# EAGLE design SparkFun_Qwiic_6DoF_BMI270 (EAGLE 9.6.2)
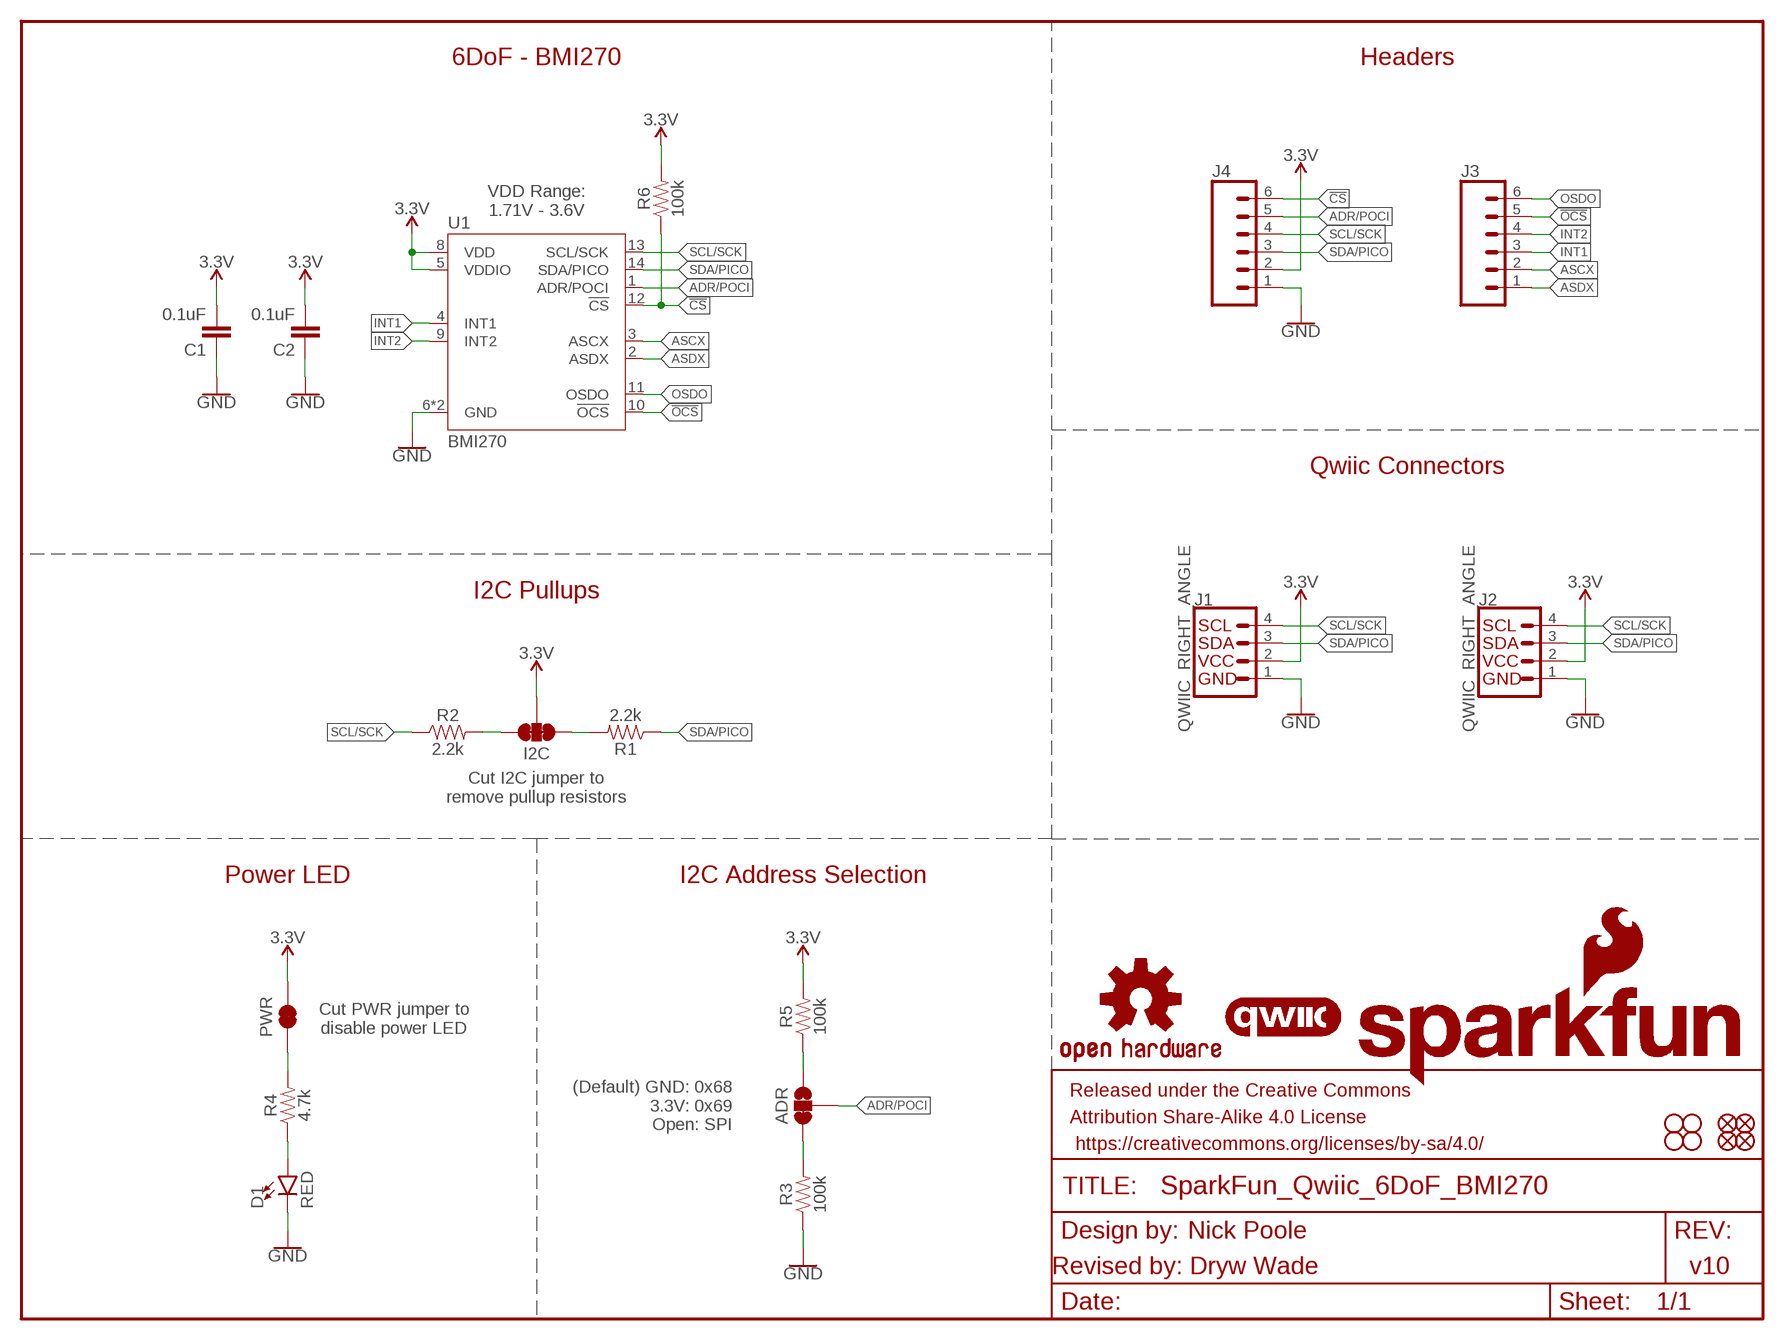
[diagram p0: schematic, sheet 1]

## Parts
ADR  JUMPER-SMT_3_1-NC_TRACE_SILK  [SMT-JUMPER_3_1-NC_TRACE_SILK]
C1  0.1uF  0.1UF-0603-25V-(+80/-20%)  [0603]
C2  0.1uF  0.1UF-0603-25V-(+80/-20%)  [0603]
D1  RED  LED-RED_0603-KB  [LED-0603]
FD1  FIDUCIAL1X2  [FIDUCIAL-1X2]
FD2  FIDUCIAL1X2  [FIDUCIAL-1X2]
FD3  FIDUCIAL1X2  [FIDUCIAL-1X2]
FD4  FIDUCIAL1X2  [FIDUCIAL-1X2]
FRAME1  FRAME-LETTER  [CREATIVE_COMMONS]
H1  STAND-OFF  [STAND-OFF]
H2  STAND-OFF  [STAND-OFF]
H3  STAND-OFF  [STAND-OFF]
H4  STAND-OFF  [STAND-OFF]
I2C  JUMPER-SMT_3_2-NC_TRACE_SILK  [SMT-JUMPER_3_2-NC_TRACE_SILK]
J1  QWIIC_RIGHT_ANGLE  QWIIC_CONNECTORJS-1MM  [JST04_1MM_RA]
J2  QWIIC_RIGHT_ANGLE  QWIIC_CONNECTORJS-1MM  [JST04_1MM_RA]
J3  CONN_06NO_SILK_NO_POP  [1X06_NO_SILK]
J4  CONN_06NO_SILK_NO_POP  [1X06_NO_SILK]
LOGO1  SFE_LOGO_NAME_FLAME.1_INCH  [SFE_LOGO_NAME_FLAME_.1]
LOGO2  QWIIC_LOGO_5MM  [QWIIC_5MM]
LOGO3  OSHW-LOGOS  [OSHW-LOGO-S]
PWR  JUMPER-SMT_2_NC_TRACE_SILK  [SMT-JUMPER_2_NC_TRACE_SILK]
R1  2.2k  2.2KOHM-0603-1/10W-1%  [0603]
R2  2.2k  2.2KOHM-0603-1/10W-1%  [0603]
R3  100k  100KOHM-0603-1/10W-1%  [0603]
R4  4.7k  4.7KOHM-0603-1/10W-1%  [0603]
R5  100k  100KOHM-0603-1/10W-1%  [0603]
R6  100k  100KOHM-0603-1/10W-1%  [0603]
U1  BMI270  [BMI270]

## Nets
3.3V: C1.2 C2.2 I2C.2 J1.2 J2.2 J4.2 PWR.2 R5.2 R6.2 U1.5(VDDIO) U1.8(VDD)
!CS!: J4.6 R6.1 U1.12(!CS!)
!OCS!: J3.5 U1.10(!OCS!)
ADR/POCI: ADR.2 J4.5 U1.1(ADR/POCI)
ASCX: J3.2 U1.3(ASCX)
ASDX: J3.1 U1.2(ASDX)
GND: C1.1 C2.1 D1.C J1.1 J2.1 J4.1 R3.1 U1.6(GND) U1.7(GND)
INT1: J3.3 U1.4(INT1)
INT2: J3.4 U1.9(INT2)
N$1: I2C.1 R1.2
N$2: I2C.3 R2.2
N$3: PWR.1 R4.2
N$4: D1.A R4.1
N$5: ADR.1 R5.1
N$6: ADR.3 R3.2
OSDO: J3.6 U1.11(OSDO)
SCL/SCK: J1.4 J2.4 J4.4 R2.1 U1.13(SCL/SCK)
SDA/PICO: J1.3 J2.3 J4.3 R1.1 U1.14(SDA/PICO)

## Notes on the sheet
- 6DoF - BMI270 | Headers
- VDD Range:
  1.71V - 3.6V
- Qwiic Connectors
- I2C Pullups
- Cut I2C jumper to
  remove pullup resistors
- Power LED | I2C Address Selection
- Cut PWR jumper to
  disable power LED
- (Default) GND: 0x68
  3.3V: 0x69
  Open: SPI
- Nick Poole
- Revised by: Dryw Wade | v10

## Library data of the parts
ADR = SparkFun-Jumpers:JUMPER-SMT_3_1-NC_TRACE: Normally closed trace jumper (1 of 2 connections) This jumper has a trace between two pads so it's normally closed (NC). The other connection is normally open (NO). Use a razor knife to open the connection. For best results follow the IPC guidelines for cutting traces: Cutout at least 0.063 mm (0.005 in). Remove all loose material to clean up the cut area. Seal the cut with an approved epoxy. Reapply solder to reclose the connection, or to close the NO connection.
C1 C2 = SparkFun-Capacitors:0.1UF: 0.1µF ceramic capacitors A capacitor is a passive two-terminal electrical component used to store electrical energy temporarily in an electric field.; PROD_ID: CAP-00810
D1 = SparkFun-LED:LED-RED: Red SMD LED Used in manufacturing of most products at SparkFun Packages: 0603 - KB - KingBright (DIO-17976) SMD 0603 package [Datasheet] <https://www.kingbrightusa.com/images/catalog/SPEC/APT1608SURCK.pdf> 0603 - (DIO-00819, has gone EOL) SMD 0603 package 0603 SMART - SMD 0603 SMART package ( more efficient and expensive)[Product Link] <http://www.osram-os.com/Graphics/XPic2/00077099_0.pdf> 1206 - SMD1206 package [Product Link] <https://www.sparkfun.com/datasheets/DevTools/LilyPad/Q150OVS4.pdff> SparkFun Products: Pro Mini 328 -5V <https://www.sparkfun.com/products/821> RedBoard <https://www.sparkfun.com/products/12757> IOIO-OTG <https://www.sparkfun.com/products/13613>; PROD_ID: DIO-17976
FD1-FD4 = SparkFun-Aesthetics:FIDUCIAL: Fiducial Alignment Points Point-of-reference for pick-and-place machines and other optical instruments.
FRAME1 = SparkFun-Aesthetics:FRAME-LETTER: Schematic Frame - Letter Standard 8.5x11 US Letter frame
H1-H4 = SparkFun-Hardware:STAND-OFF: Stand Off Drill holes for mechanically mounting via screws, standoffs, etc. Note: Use the keepout ring to avoid running the screw head into surrounding components. Variant Overviews STAND-OFF - Mechanical footprint for a #4 phillips button head screw. STAND-OFF-TIGHT - Mechanical footprint for a #4 phillips button head screw, Example SparkFun Products Screw - Phillips Head (1/4", 4-40, 10 pack) <https://www.sparkfun.com/products/10453> (PRT-10453) Screw - Phillips Head (1/2", 4-40, 10 pack) <https://www.sparkfun.com/products/10452> (PRT-10452) Screw - Phillips Head (3/4", 4-40, 10 pack) <https://www.sparkfun.com/products/10451> (PRT-10451) Screw - Phillips Head (1", 4-40, 10 pack) <https://www.sparkfun.com/products/10450> (PRT-10450)
I2C = SparkFun-Jumpers:JUMPER-SMT_3_2-NC_TRACE: Normally closed trace jumper (2 of 2 connections) This jumper has a trace between all three pads so they are normally closed (NC). Use a razor knife to open the connection(s). For best results follow the IPC guidelines for cutting traces: Cutout at least 0.063 mm (0.005 in). Remove all loose material to clean up the cut area. Seal the cut with an approved epoxy. Reapply solder to reclose the connection(s).
J1 J2 = SparkFun-Connectors:QWIIC_CONNECTOR: SparkFun I2C Standard Qwiic Connector An SMD 1mm pitch JST connector makes it easy and quick (get it? Qwiic?) to connect I2C devices to each other. The Qwiic system <http://www.sparkfun.com/qwiic> enables fast and solderless connection between popular platforms and various sensors and actuators. We carry 200mm <https://www.sparkfun.com/products/14204>, 100mm <https://www.sparkfun.com/products/14205>, 50mm <https://www.sparkfun.com/products/14206>, and breadboard friendly <https://www.sparkfun.com/products/14207> Qwiic cables. We also offer 10 pcs strips <https://www.sparkfun.com/products/14323> the SMD connectors.; PROD_ID: CONN-13694
J3 J4 = SparkFun-Connectors:CONN_06: Multi connection point. Often used as Generic Header-pin footprint for 0.1 inch spaced/style header connections On any of the 0.1 inch spaced packages, you can populate with these: Break Away Headers - Straight <https://www.sparkfun.com/products/116> (PRT-00116) Break Away Male Headers - Right Angle <https://www.sparkfun.com/products/553> (PRT-00553) Female Headers <https://www.sparkfun.com/products/115> (PRT-00115) Break Away Headers - Machine Pin <https://www.sparkfun.com/products/117> (PRT-00117) Break Away Female Headers - Swiss Machine Pin <https://www.sparkfun.com/products/743> (PRT-00743) Arduino Stackable Header - 6 Pin <https://www.sparkfun.com/products/9280> (PRT-09280) Screw Terminals 2.54mm Pitch (6-Pin) <https://www.sparkfun.com/products/16499> (PRT-16499) For SCREWTERMINALS and SPRING TERMINALS visit here: Screw Terimnals on SparkFun.com <https://www.sparkfun.com/search/results?term=Screw+Terminals> (5mm/3.5mm/2.54mm spacing) This device is also useful as a general connection point to wire up your design to another part of your project. Our various solder wires solder well into these plated through hole pads. Hook-Up Wire - Assortment (Stranded, 22 AWG) <https://www.sparkfun.com/products/11375> (PRT-11375) Hook-Up Wire - Assortment (Solid Core, 22 AWG) <https://www.sparkfun.com/products/11367> (PRT-11367) View the entire wire category on our website here <https://www.sparkfun.com/categories/141>
LOGO1 = SparkFun-Aesthetics:SFE_LOGO_NAME_FLAME: SparkFun Font Logo w/ Flame This is the SparkFun full logo. The logo on the schematic will always be the same size; the package variant is the height of the flame part of the logo. Default layer for the logo on the board is tSilk.
LOGO2 = SparkFun-Aesthetics:QWIIC_LOGO: Qwiic Logos for placement on schematic and PCB. The 5.5mm silk logo is best for placing next to Qwiic connector.
LOGO3 = SparkFun-Aesthetics:OSHW-LOGO: Open-Source Hardware (OSHW) Logo This logo indicates the piece of hardware it is found on incorporates a OSHW license and/or adheres to the definition of open source hardware found here: http://freedomdefined.org/OSHW
PWR = SparkFun-Jumpers:JUMPER-SMT_2_NC_TRACE: Normally closed trace jumper This jumper has a trace between two pads so it's normally closed (NC). Use a razor knife to open the connection. For best results follow the IPC guidelines for cutting traces: Cutout at least 0.063 mm (0.005 in). Remove all loose material to clean up the cut area. Seal the cut with an approved epoxy. Reapply solder to reclose the connection.
R1 R2 = SparkFun-Resistors:2.2KOHM: 2.2kΩ resistor A resistor is a passive two-terminal electrical component that implements electrical resistance as a circuit element. Resistors act to reduce current flow, and, at the same time, act to lower voltage levels within circuits. - Wikipedia; PROD_ID: RES-08272
R3 R5 R6 = SparkFun-Resistors:100KOHM: 100kΩ resistor A resistor is a passive two-terminal electrical component that implements electrical resistance as a circuit element. Resistors act to reduce current flow, and, at the same time, act to lower voltage levels within circuits. - Wikipedia; PROD_ID: RES-07828
R4 = SparkFun-Resistors:4.7KOHM: 4.7kΩ resistor A resistor is a passive two-terminal electrical component that implements electrical resistance as a circuit element. Resistors act to reduce current flow, and, at the same time, act to lower voltage levels within circuits. - Wikipedia; PROD_ID: RES-07857
U1 = BMI270:BMI270; PROD_ID: IC-15423

## Board
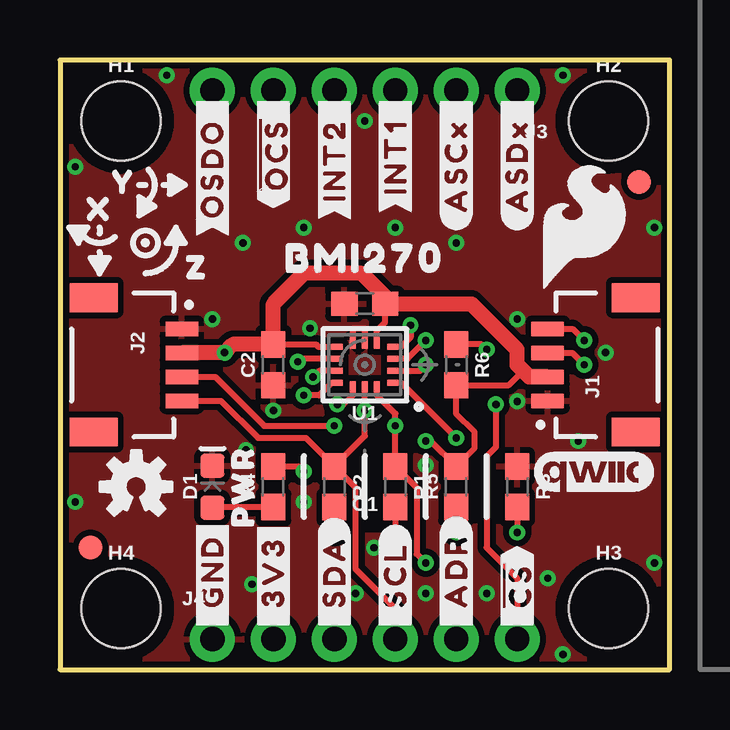
[diagram p1: board, top side]
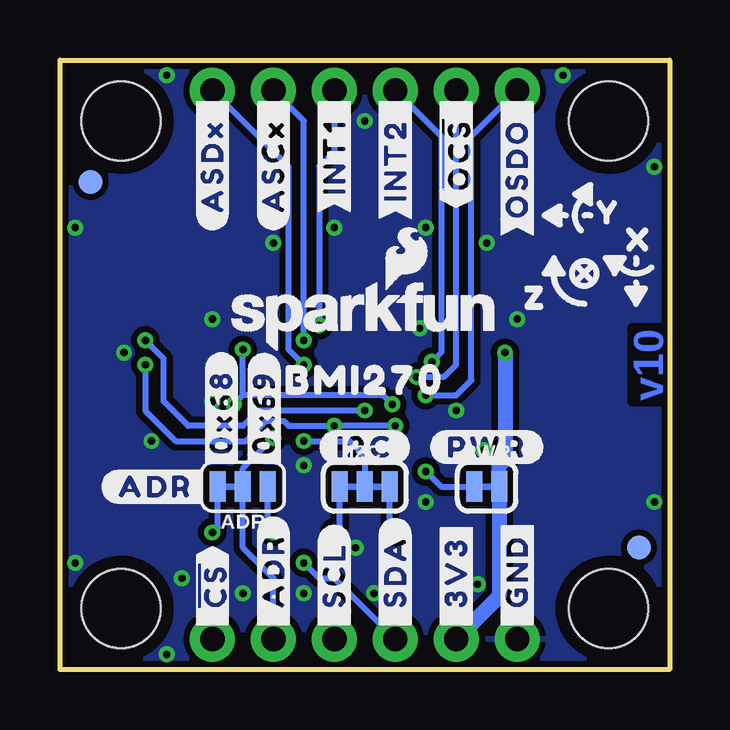
[diagram p2: board, bottom side, seen from below]

Size 25.4 x 25.4 mm. Coordinates in mm from the lower left corner, seen from the top.
Outline: 0,0 25.4,0 25.4,25.4 0,25.4 0,0
Copper layers (1*16): Top 0.035mm / dielectric 1.5mm / Bottom 0.035mm
Design rules "SparkFun-2-Layer-General-JLCPCB": minimum track width 7mil, minimum drill 0.3mm, track to track 7mil, track to pad 7mil, pad to pad 7mil, via to via 7mil, smd to smd 7mil, copper to edge 7mil, drill to drill 7mil, minimum pad ring 7mil, minimum via ring 7mil, stop-mask expansion 3mil, vias tented up to drill 25mil, thermal gap 10mil
tRestrict: area 12.4,13.5 to 12.5,13.7; area 12.8,6 to 13.2,6.2

### Footprints (pad centres in the part's own frame; a part is rotated, then mirrored left to right if it is on the bottom)
SMT-JUMPER_3_1-NC_TRACE_SILK = smd 0.66 x 1.27: 1 -1.041,0; 2 0,0; 3 1.041,0
0603 = smd 1.1 x 1: 1 -0.85,0; 2 0.85,0
LED-0603 = smd 1 x 1: A -0.877,0; C 0.877,0
FIDUCIAL-1X2 = smd 1 x 1: 1 0,0
STAND-OFF = hole 3.302: 0,0
SMT-JUMPER_3_2-NC_TRACE_SILK = smd 0.66 x 1.27: 1 -1.041,0; 2 0,0; 3 1.041,0
JST04_1MM_RA = smd 0.6 x 1.35: 1 -1.5,0; 2 -0.5,0; 3 0.5,0; 4 1.5,0 | smd 1.2 x 2: NC1 2.8,-3.675; NC2 -2.8,-3.675
1X06_NO_SILK = drill 1.016 pad 1.88: 1 0,0; 2 2.54,0; 3 5.08,0; 4 7.62,0; 5 10.16,0; 6 12.7,0
SMT-JUMPER_2_NC_TRACE_SILK = smd 0.66 x 1.27: 1 -0.521,0; 2 0.521,0
BMI270 = smd 0.475 x 0.25: 1 -1.163,0.75; 2 -1.163,0.25; 3 -1.163,-0.25; 4 -1.163,-0.75; 8 1.163,-0.75; 9 1.163,-0.25; 10 1.163,0.25; 11 1.163,0.75 | smd 0.25 x 0.475: 5 -0.5,-0.912; 6 0,-0.912; 7 0.5,-0.912; 12 0.5,0.912; 13 0,0.912; 14 -0.5,0.912

### Placement (x,y rotation side)
ADR  17.78,7.62 180 bottom
C1  12.7,15.24 0 top
C2  8.89,12.7 90 top
D1  6.35,7.62 90 top
FD1  1.27,5.08 0 top
FD2  24.13,20.32 0 top
FD3  24.13,20.32 0 bottom
FD4  1.27,5.08 0 bottom
FRAME1  -10.16,-25.4 0 top  (outside the outline)
H1  2.54,22.86 0 top
H2  22.86,22.86 0 top
H3  22.86,2.54 0 top
H4  2.54,2.54 0 top
I2C  12.7,7.62 0 bottom
J1  20.32,12.7 90 top
J2  5.08,12.7 270 top
J3  19.05,24.13 180 top
J4  6.35,1.27 0 top
LOGO1  12.7,14.73 0 bottom
LOGO2  22.23,8.26 0 top
LOGO3  3.17,7.62 0 top
PWR  7.62,7.62 0 bottom
R1  13.97,7.62 270 top
R2  11.43,7.62 270 top
R3  19.05,7.62 270 top
R4  8.89,7.62 90 top
R5  16.51,7.62 90 top
R6  16.51,12.7 270 top
U1  12.7,12.7 180 top
U$1  [#I2C#0]  12.7,9.27 0 bottom
U$2  [#_SDA#0]  11.43,1.52 90 top
U$3  [SFE_LOGO_FLAME_.2]  21.84,18.41 0 top
U$4  [#PWR#0]  7.62,9.27 0 bottom
U$5  [#ADR#0]  19.18,7.62 0 bottom
U$6  [#0X68#0]  18.67,8.26 90 bottom
U$7  [#_3V3#0]  8.89,1.52 90 top
U$8  [#_#CS##0]  19.05,1.52 90 top
U$9  [#_ADR#0]  16.51,1.52 90 top
U$10  [#_SCL#0]  13.97,1.52 90 top
U$11  [#ASDX_#0]  19.05,24 90 top
U$12  [#_GND#0]  6.35,1.52 90 bottom
U$13  [#_3V3#0]  8.89,1.52 90 bottom
U$14  [#_SDA#0]  11.43,1.52 90 bottom
U$15  [#_SCL#0]  13.97,1.52 90 bottom
U$16  [#_ADR#0]  16.51,1.52 90 bottom
U$17  [#_#CS##0]  19.05,1.52 90 bottom
U$18  [#0X69#0]  16.89,8.26 90 bottom
U$19  [#_GND#0]  6.35,1.52 90 top
U$20  [BMI2700]  12.7,12.06 0 bottom
U$21  [BMI2700]  12.7,17.14 0 top
U$22  [#ASCX_#0]  16.51,24 90 top
U$23  [#INT1_#0]  13.97,24 90 top
U$24  [#INT2_#0]  11.43,24 90 top
U$25  [##OCS#_#0]  8.89,24 90 top
U$26  [#OSDO_#0]  6.35,24 90 top
U$27  [#ASDX_#0]  19.05,24 90 bottom
U$28  [#ASCX_#0]  16.51,24 90 bottom
U$29  [#INT1_#0]  13.97,24 90 bottom
U$30  [#INT2_#0]  11.43,24 90 bottom
U$31  [##OCS#_#0]  8.89,24 90 bottom
U$32  [#OSDO_#0]  6.35,24 90 bottom
U$33  [ORDERING_INSTRUCTIONS]  26.67,50.8 0 top  (outside the outline)
U$34  [PWR0]  7.62,7.62 90 top
U$79  [X0]  1.27,17.91 0 bottom
U$80  [Y0]  2.54,19.05 0 bottom
U$81  [Z0]  5.59,15.49 0 bottom
U$88  [X0]  1.65,19.18 0 top
U$89  [Y0]  2.67,20.32 0 top
U$90  [Z0]  5.71,16.76 0 top

### Tracks (layer width: path | path; a pad name or v marks a point on that pad's centre or on a via)
3.3V  (via drill 0.3)
  Top 0.254: U1.5 13.2,14.13 13.55,14.48 C1.2 | C2.2 10.67,13.55 10.77,13.45 U1.8 | v15.24,9.53 15.46,9.53 R5.2 17.27,9.23 17.27,9.91 16.51,10.67 R6.2 18.71,11.85 19.3,12.45
  Top 0.635: J2.2 v6.85,13.2 v6.86,13.21 7.2,13.55 C2.2 8.89,15.24 10.16,16.51 12.57,16.51 13.55,15.53 C1.2 17.14,15.24 19.05,13.34 19.05,12.7 19.3,12.45 19.55,12.2 J1.2
  Bottom 0.254: v15.24,9.53 13.34,9.53 12.7,8.89 I2C.2
  Bottom 0.635: v6.86,13.21 6.84,13.2 6.84,8.76 7.1,8.51 PWR.2 7.1,3.06 J4.2
!CS!  (via drill 0.3)
  Top 0.254: v17.78,13.34 17.57,13.55 R6.1 | U1.12 12.2,11.44 11.81,11.05 v11.56,11.05 | v18.16,11.05 18.16,9.27 17.78,8.89 17.78,5.08 19.05,3.81 J4.6
  Bottom 0.254: 17.78,11.43 v17.78,13.34 | 17.78,11.43 11.94,11.43 v11.56,11.05 | 17.78,11.43 v18.16,11.05
!OCS!  (via drill 0.3)
  Top 0.254: U1.10 10.8,12.45 v10.54,12.19
  Bottom 0.254: v10.54,12.19 9.4,12.19 8.89,12.7 J3.5
ADR/POCI  (via drill 0.3)
  Top 0.254: v16.51,9.65 14.21,11.95 U1.1
  Bottom 0.254: J4.5 16.51,3.81 17.78,5.08 ADR.2 17.78,8.38 v16.51,9.65
ASCX  (via drill 0.3)
  Top 0.254: U1.3 14.47,12.95 v15.24,13.72
  Bottom 0.254: J3.2 15.24,22.86 v15.24,13.72
ASDX  (via drill 0.3)
  Top 0.254: U1.2 14.99,12.45 v15.24,12.7
  Bottom 0.254: J3.1 15.88,20.95 15.88,13.34 v15.24,12.7
GND  (via drill 0.3)
  Top 0.254: U1.6 12.7,14.22 12.2,14.22 U1.7
  other vias: 0.64,20.95 4.45,24.77 0.64,6.99 10.16,6.99 8.89,10.79 6.35,14.61 19.05,11.18 10.41,14.22 20.95,0.64 24.77,4.45 24.77,18.41 20.95,24.77 15.24,3.17 17.78,3.17 13.08,5.08 20.32,3.81 10.16,18.41 13.97,18.41 16.51,17.78 7.62,17.78 12.7,22.86 21.59,9.53 8,3.56 7.75,9.14 15.24,8.51 19.05,14.61 12.32,3.17 22.73,13.21
  pour Top (isolate 0.254): 0,0 25.4,0 25.4,25.4 0,25.4
  pour Bottom (isolate 0.254): 0,0 25.4,0 25.4,25.4 0,25.4
INT1  (via drill 0.3)
  Top 0.254: U1.4 14.21,13.45 14.61,13.84 v14.61,14.35
  Bottom 0.254: J3.3 13.97,21.59 14.61,20.95 v14.61,14.35
INT2  (via drill 0.3)
  Top 0.254: U1.9 10.03,12.95 v9.91,12.83
  Bottom 0.254: v9.91,12.83 9.53,13.21 9.53,22.23 J3.4
N$1  (via drill 0.3)
  Top 0.254: R1.2 v13.97,5.71
  Bottom 0.254: v13.97,5.71 13.74,5.94 I2C.1
N$2  (via drill 0.3)
  Top 0.254: R2.2 v11.43,5.71
  Bottom 0.254: v11.43,5.71 11.66,5.94 I2C.3
N$3  (via drill 0.3)
  Top 0.254: R4.2 9.95,8.47 v10.16,8.26
  Bottom 0.254: v10.16,8.26 9.53,7.62 PWR.1
N$4
  Top 0.254: R4.1 6.38,6.77 D1.A
N$5  (via drill 0.3)
  Top 0.254: R5.1 v16.51,5.71
  Bottom 0.254: v16.51,5.71 16.74,5.94 ADR.1
N$6  (via drill 0.3)
  Top 0.254: R3.2 v19.05,5.71
  Bottom 0.254: v19.05,5.71 18.82,5.94 ADR.3
OSDO  (via drill 0.3)
  Top 0.254: U1.11 11.31,11.95 10.79,11.43 v10.16,11.43
  Bottom 0.254: v10.16,11.43 8.89,11.43 8.26,12.06 8.26,22.23 J3.6
SCL/SCK  (via drill 0.3)
  Top 0.254: R2.1 12.7,9.74 v12.7,10.79 U1.13 | R2.1 12.32,7.58 12.32,4.19 13.97,2.54 J4.4 | J2.4 6.71,11.2 8.26,9.65 10.25,9.65 R2.1 | J1.4 21.36,14.2 v21.84,13.72
  Bottom 0.254: v12.7,10.79 17.14,10.79 17.78,10.16 20.07,10.16 21.08,11.18 21.08,12.95 v21.84,13.72
SDA/PICO  (via drill 0.3)
  Top 0.254: v15.24,4.45 14.86,4.83 14.86,7.58 R1.1 v13.97,10.16 13.97,10.67 13.2,11.44 U1.14 | J2.3 6.47,12.2 8.51,10.16 v11.43,10.16 | J1.3 21.34,13.2 v21.84,12.7
  Bottom 0.254: v15.24,4.45 14.61,3.81 13.97,3.81 J4.3 | v11.43,10.16 v13.97,10.16 15.88,10.16 16.08,10.36 16.82,10.36 17.65,9.53 20.57,9.53 21.84,10.79 v21.84,12.7

### Text on the board
Bottom: v10
Measures: Units: inches
tDocu: Solder Mask: Red / Thickness: 1.6mm / Two layer design / Finish: Lead Free HASL | Nick Poole | Revised by: Dryw Wade